# EAGLE design DragonHeadv2 (EAGLE 9.6.2)
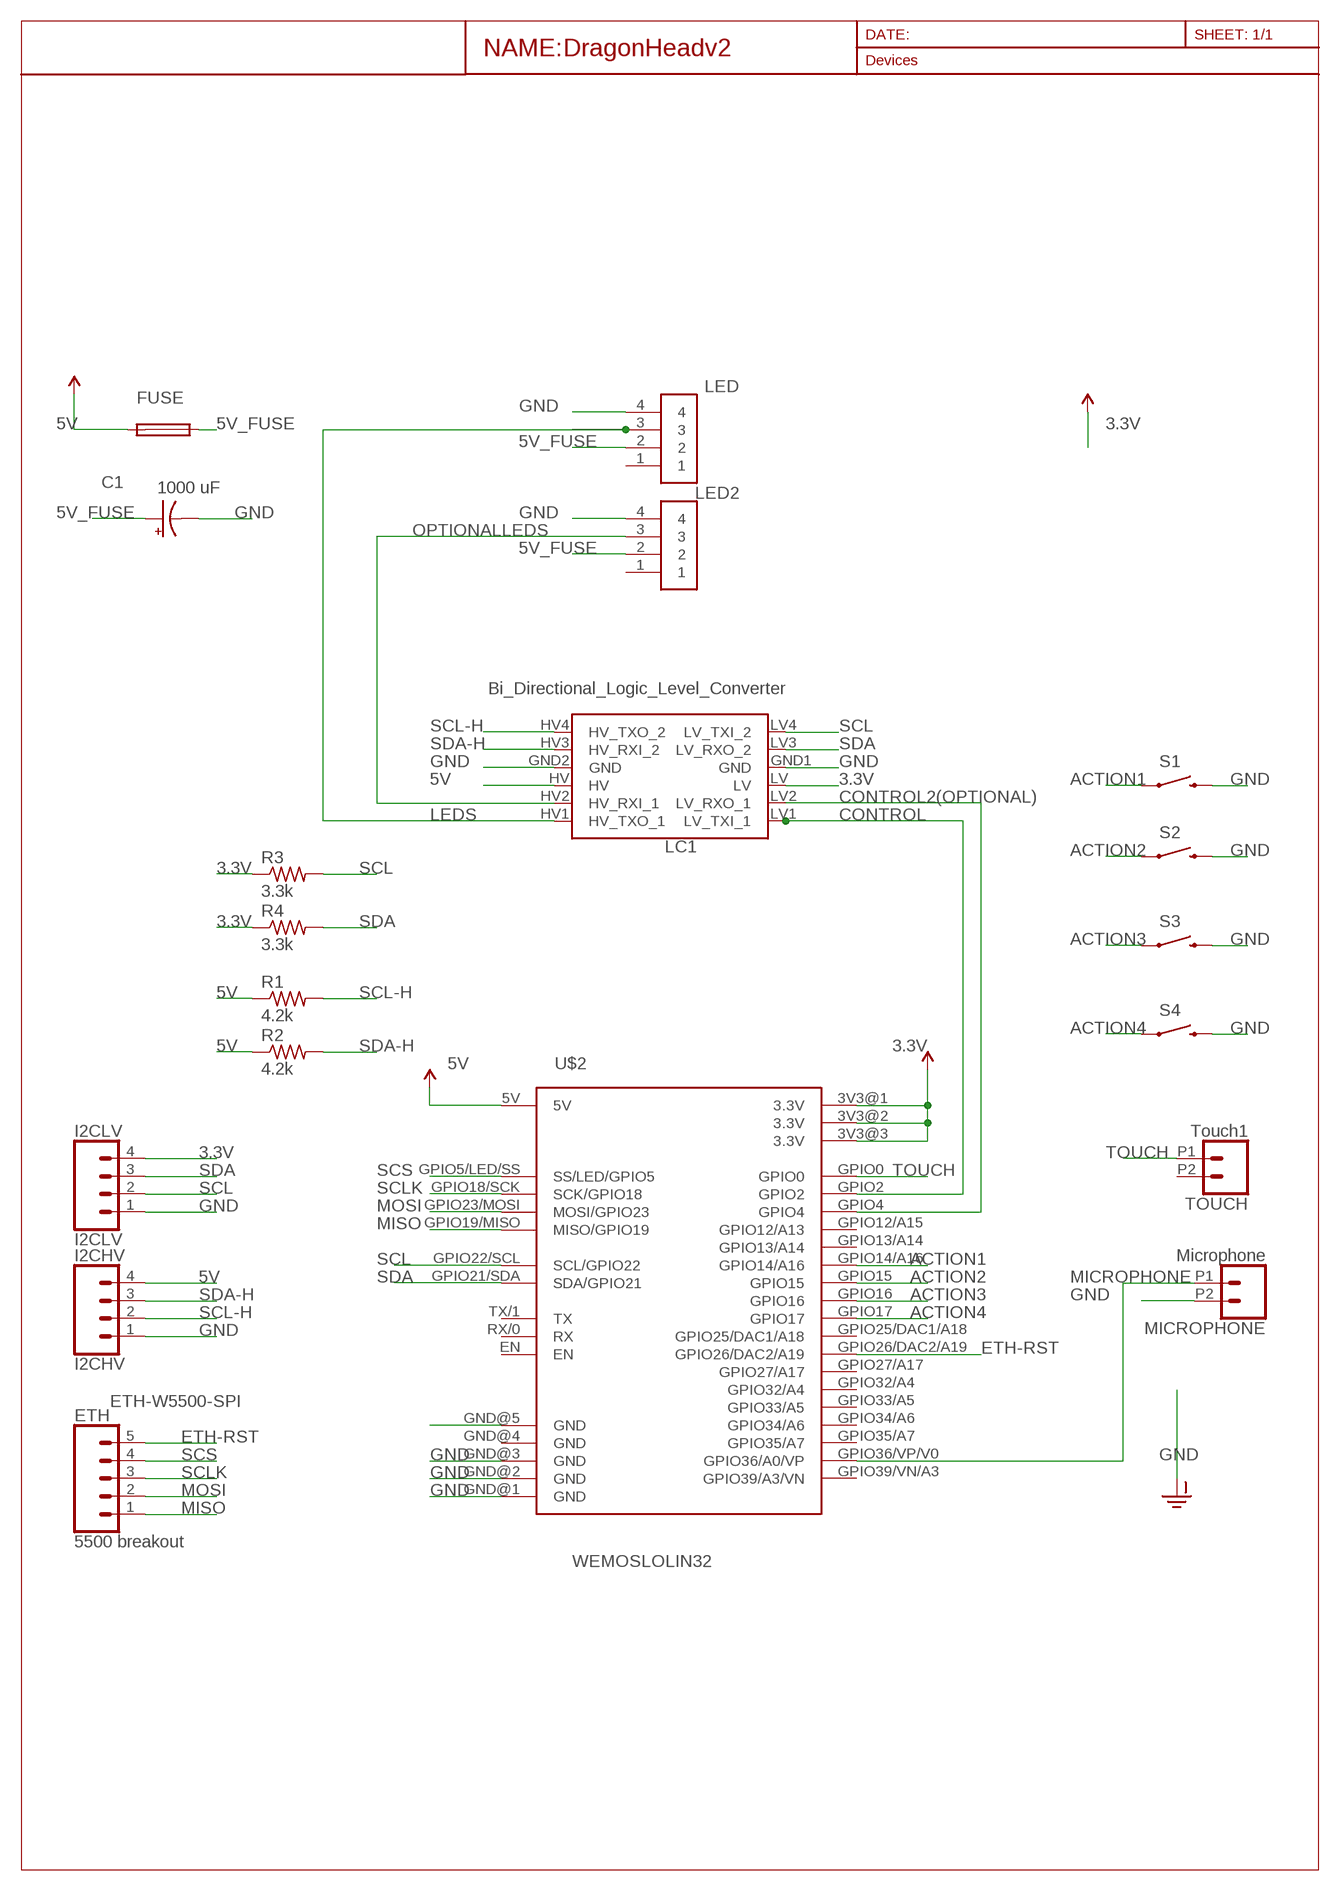
[diagram p0: schematic, sheet 1]

## Parts
C1  1000 uF  1000UF-RADIAL-5MM-25V-20%  [CPOL-RADIAL-5MM-10MM]
ETH  5500 breakout  CONN_05  [1X05]
FUSE  FUSEBLANK_5X20MM  [FUSE_HOLDER_5X20MM]
I2CHV  I2CHV  CONN_04PTH  [1X04]
I2CLV  I2CLV  CONN_04PTH  [1X04]
LC1  Bi_Directional_Logic_Level_Converter  SPARKFUN_LOGIC_LEVEL_CONVERTER  [SPARKFUN_LOGIC_LEVEL_CONVERTER]
LED  231-334/001-000  [WAGO_231-334/001-000]
LED2  231-334/001-000  [WAGO_231-334/001-000]
MICROPHONE  Microphone  CONN_022.54MM_SCREWTERM  [1X02_2.54_SCREWTERM]
R1  4.2k  R-US_0204/7  [0204/7]
R2  4.2k  R-US_0204/7  [0204/7]
R3  3.3k  R-US_0204/7  [0204/7]
R4  3.3k  R-US_0204/7  [0204/7]
S1  SWITCH-MOMENTARY-2SIDE_EZ  [TACTILE-PTH-SIDEEZ]
S2  SWITCH-MOMENTARY-2SIDE_EZ  [TACTILE-PTH-SIDEEZ]
S3  SWITCH-MOMENTARY-2SIDE_EZ  [TACTILE-PTH-SIDEEZ]
S4  SWITCH-MOMENTARY-2SIDE_EZ  [TACTILE-PTH-SIDEEZ]
TOUCH  Touch1  CONN_022.54MM_SCREWTERM  [1X02_2.54_SCREWTERM]
U$2  WEMOSLOLIN32  [LOLIN32VAR1]

## Nets
3.3V: I2CLV.4 LC1.LV R3.1 R4.1 U$2.3V3@1(3.3V) U$2.3V3@2(3.3V) U$2.3V3@3(3.3V)
5V: FUSE.2 I2CHV.4 LC1.HV R1.1 R2.1 U$2.5V
5V_FUSE: C1.+ FUSE.1 LED2.2 LED.2
ACTION1: S1.1 U$2.GPIO14/A16
ACTION2: S2.1 U$2.GPIO15
ACTION3: S3.1 U$2.GPIO16
ACTION4: S4.1 U$2.GPIO17
CONTROL: LC1.LV1(LV_TXI_1) U$2.GPIO2
CONTROL2(OPTIONAL): LC1.LV2(LV_RXO_1) U$2.GPIO4
ETH-RST: ETH.5 U$2.GPIO26/DAC2/A19
GND: C1.- I2CHV.1 I2CLV.1 LC1.GND1(GND) LC1.GND2(GND) LED2.4 LED.4 MICROPHONE.P2 S1.2 S2.2 S3.2 S4.2 U$2.GND@1(GND) U$2.GND@2(GND) U$2.GND@3(GND) U$2.GND@5(GND) ; supply symbol labelled GND-ISO
LEDS: LC1.HV1(HV_TXO_1) LED.3
MICROPHONE: MICROPHONE.P1 U$2.GPIO36/VP/V0(GPIO36/A0/VP)
MISO: ETH.1 U$2.GPIO19/MISO(MISO/GPIO19)
MOSI: ETH.2 U$2.GPIO23/MOSI(MOSI/GPIO23)
OPTIONALLEDS: LC1.HV2(HV_RXI_1) LED2.3
SCL: I2CLV.2 LC1.LV4(LV_TXI_2) R3.2 U$2.GPIO22/SCL(SCL/GPIO22)
SCL-H: I2CHV.2 LC1.HV4(HV_TXO_2) R1.2
SCLK: ETH.3 U$2.GPIO18/SCK(SCK/GPIO18)
SCS: ETH.4 U$2.GPIO5/LED/SS(SS/LED/GPIO5)
SDA: I2CLV.3 LC1.LV3(LV_RXO_2) R4.2 U$2.GPIO21/SDA(SDA/GPIO21)
SDA-H: I2CHV.3 LC1.HV3(HV_RXI_2) R2.2
TOUCH: TOUCH.P1 U$2.GPIO0
Unconnected: LED2.1 LED.1 TOUCH.P2 U$2.EN U$2.GND@4(GND) U$2.GPIO12/A15(GPIO12/A13) U$2.GPIO13/A14 U$2.GPIO25/DAC1/A18 U$2.GPIO27/A17 U$2.GPIO32/A4 U$2.GPIO33/A5 U$2.GPIO34/A6 U$2.GPIO35/A7 U$2.GPIO39/VN/A3(GPIO39/A3/VN) U$2.RX/0(RX) U$2.TX/1(TX)

## Library data of the parts
C1 = SparkFun-Capacitors:1000UF: 1,000µF/1mF ceramic capacitors A capacitor is a passive two-terminal electrical component used to store electrical energy temporarily in an electric field. CAP-08070; PROD_ID: CAP-09538; VALUE: 1mF
ETH = SparkFun-Connectors:CONN_05: Multi connection point. Often used as Generic Header-pin footprint for 0.1 inch spaced/style header connections On any of the 0.1 inch spaced packages, you can populate with these: Break Away Headers - Straight <https://www.sparkfun.com/products/116> (PRT-00116) Break Away Male Headers - Right Angle <https://www.sparkfun.com/products/553> (PRT-00553) Female Headers <https://www.sparkfun.com/products/115> (PRT-00115) Break Away Headers - Machine Pin <https://www.sparkfun.com/products/117> (PRT-00117) Break Away Female Headers - Swiss Machine Pin <https://www.sparkfun.com/products/743> (PRT-00743) For SCREWTERMINALS and SPRING TERMINALS visit here: Screw Terimnals on SparkFun.com <https://www.sparkfun.com/search/results?term=Screw+Terminals> (5mm/3.5mm/2.54mm spacing) This device is also useful as a general connection point to wire up your design to another part of your project. Our various solder wires solder well into these plated through hole pads. Hook-Up Wire - Assortment (Stranded, 22 AWG) <https://www.sparkfun.com/products/11375> (PRT-11375) Hook-Up Wire - Assortment (Solid Core, 22 AWG) <https://www.sparkfun.com/products/11367> (PRT-11367) View the entire wire category on our website here <https://www.sparkfun.com/categories/141> Special notes: Molex polarized connector foot print use with SKU : PRT-08231 with associated crimp pins and housings. 1MM SMD Version SKU: PRT-10208
FUSE = fuse:FUSE: Fuse; OC_FARNELL: unknown; OC_NEWARK: unknown
I2CHV I2CLV = SparkFun-Connectors:CONN_04: Multi connection point. Often used as Generic Header-pin footprint for 0.1 inch spaced/style header connections On any of the 0.1 inch spaced packages, you can populate with these: Break Away Headers - Straight <https://www.sparkfun.com/products/116> (PRT-00116) Break Away Male Headers - Right Angle <https://www.sparkfun.com/products/553> (PRT-00553) Female Headers <https://www.sparkfun.com/products/115> (PRT-00115) Break Away Headers - Machine Pin <https://www.sparkfun.com/products/117> (PRT-00117) Break Away Female Headers - Swiss Machine Pin <https://www.sparkfun.com/products/743> (PRT-00743) For SCREWTERMINALS and SPRING TERMINALS visit here: Screw Terimnals on SparkFun.com <https://www.sparkfun.com/search/results?term=Screw+Terminals> (5mm/3.5mm/2.54mm spacing) This device is also useful as a general connection point to wire up your design to another part of your project. Our various solder wires solder well into these plated through hole pads. Hook-Up Wire - Assortment (Stranded, 22 AWG) <https://www.sparkfun.com/products/11375> (PRT-11375) Hook-Up Wire - Assortment (Solid Core, 22 AWG) <https://www.sparkfun.com/products/11367> (PRT-11367) View the entire wire category on our website here <https://www.sparkfun.com/categories/141> Special notes: Molex polarized connector foot print use with SKU : PRT-08231 with associated crimp pins and housings. 1MM SMD Version SKU: PRT-10208; PROD_ID: CONN-09696
LC1 = SparkFun-Boards:SPARKFUN_LOGIC_LEVEL_CONVERTER: SparkFun Logic Level Converter -Bi-Directional This is the mechnical outline for the 3.3V - 5V bi directional logic level converter. *Note, the "LOCK" Package has the header pins staggered by an offset of 5 mils (off center line), so that when you slide a row of standard 0.1" headers into the PTH pads, it will hold position vertically. See the follwing turorial for more information on this type of special footprints: Sneaky Footprints <https://www.sparkfun.com/tutorials/114> SparkFun Products: SparkFun Logic Level Converter - Bi-Directional <https://www.sparkfun.com/products/12009>
LED LED2 = 231-334_001-000:231-334/001-000: 4 Position 5.08 mm Through Hole Header Straight Solder Pin with Closed End Check availability <https://pricing.snapeda.com/parts/231-334/001-000/WAGO/view-part?ref=eda>; AVAILABILITY: In Stock; DESCRIPTION: 4 Position 5.08 mm Through Hole Header Straight Solder Pin with Closed End; MF: WAGO; MP: 231-334/001-000; PACKAGE: None; PRICE: None; PURCHASE-URL: https://pricing.snapeda.com/search/part/231-334/001-000/?ref=eda
MICROPHONE TOUCH = SparkFun-Retired:CONN_02: Multi connection point. Often used as Generic Header-pin footprint for 0.1 inch spaced/style header connections On any of the 0.1 inch spaced packages, you can populate with these: Break Away Headers - Straight <https://www.sparkfun.com/products/116> (PRT-00116) Break Away Male Headers - Right Angle <https://www.sparkfun.com/products/553> (PRT-00553) Female Headers <https://www.sparkfun.com/products/115> (PRT-00115) Break Away Headers - Machine Pin <https://www.sparkfun.com/products/117> (PRT-00117) Break Away Female Headers - Swiss Machine Pin <https://www.sparkfun.com/products/743> (PRT-00743) For SCREWTERMINALS and SPRING TERMINALS visit here: Screw Terimnals on SparkFun.com <https://www.sparkfun.com/search/results?term=Screw+Terminals> (5mm/3.5mm/2.54mm spacing) This device is also useful as a general connection point to wire up your design to another part of your project. Our various solder wires solder well into these plated through hole pads. Hook-Up Wire - Assortment (Stranded, 22 AWG) <https://www.sparkfun.com/products/11375> (PRT-11375) Hook-Up Wire - Assortment (Solid Core, 22 AWG) <https://www.sparkfun.com/products/11367> (PRT-11367) View the entire wire category on our website here <https://www.sparkfun.com/categories/141> Special notes: Molex polarized connector foot print use with: PRT-08233 with associated crimp pins and housings. 2.54_SCREWTERM for use with PRT-10571. 3.5mm Screw Terminal footprints for PRT-08084 5mm Screw Terminal footprints for use with PRT-08432
R1-R4 = adafruit:R-US_: RESISTOR, American symbol
S1-S4 = SparkFun-Electromechanical:SWITCH-MOMENTARY-2: Various NO switches- pushbuttons, reed, etc
U$2 = LOLIN32:WEMOSLOLIN32: WEMOS LOLIN32 CPU with Wifi and 4Gb flash storage

## Board
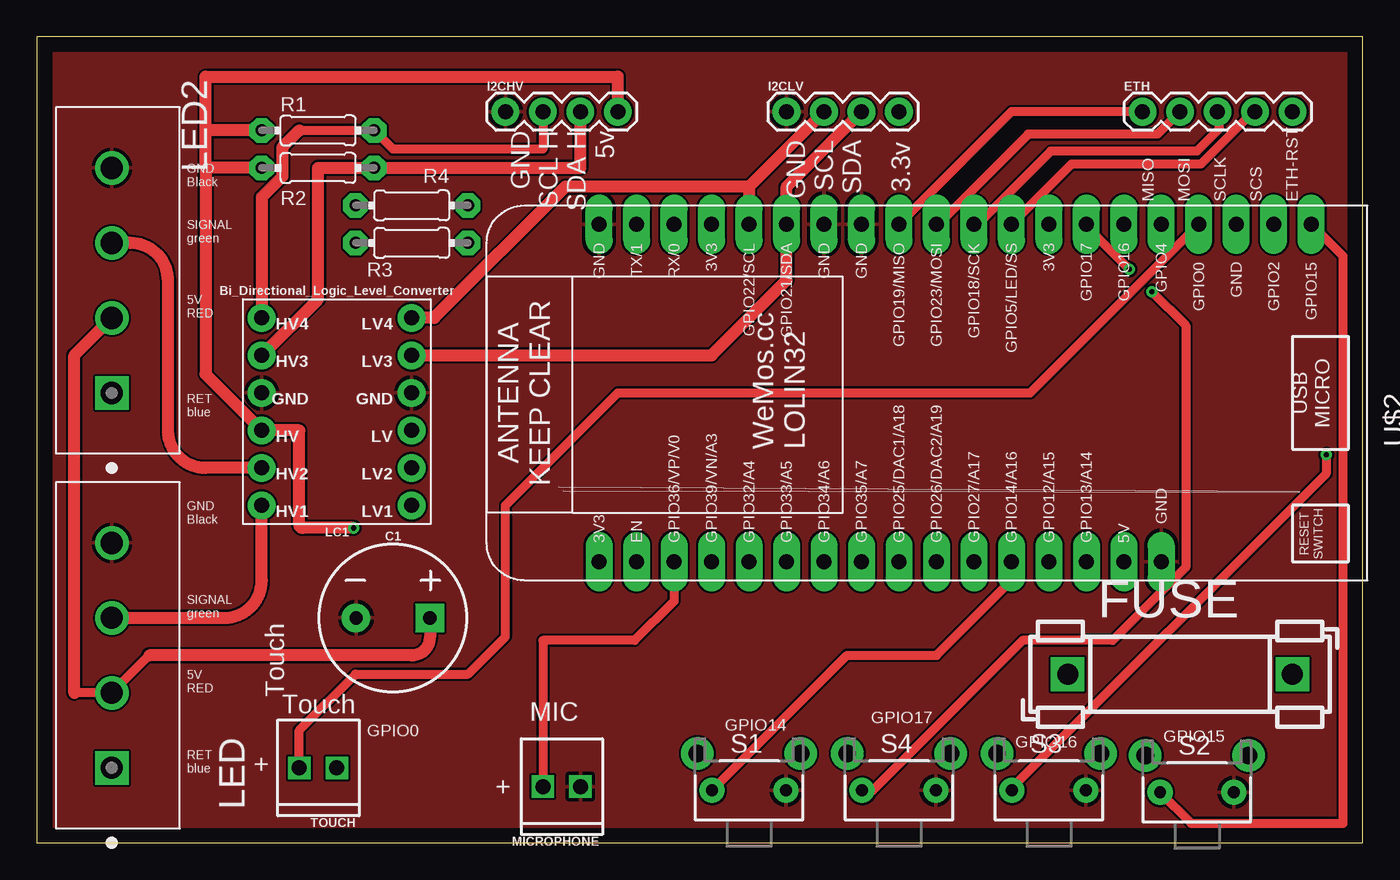
[diagram p1: board, top side]
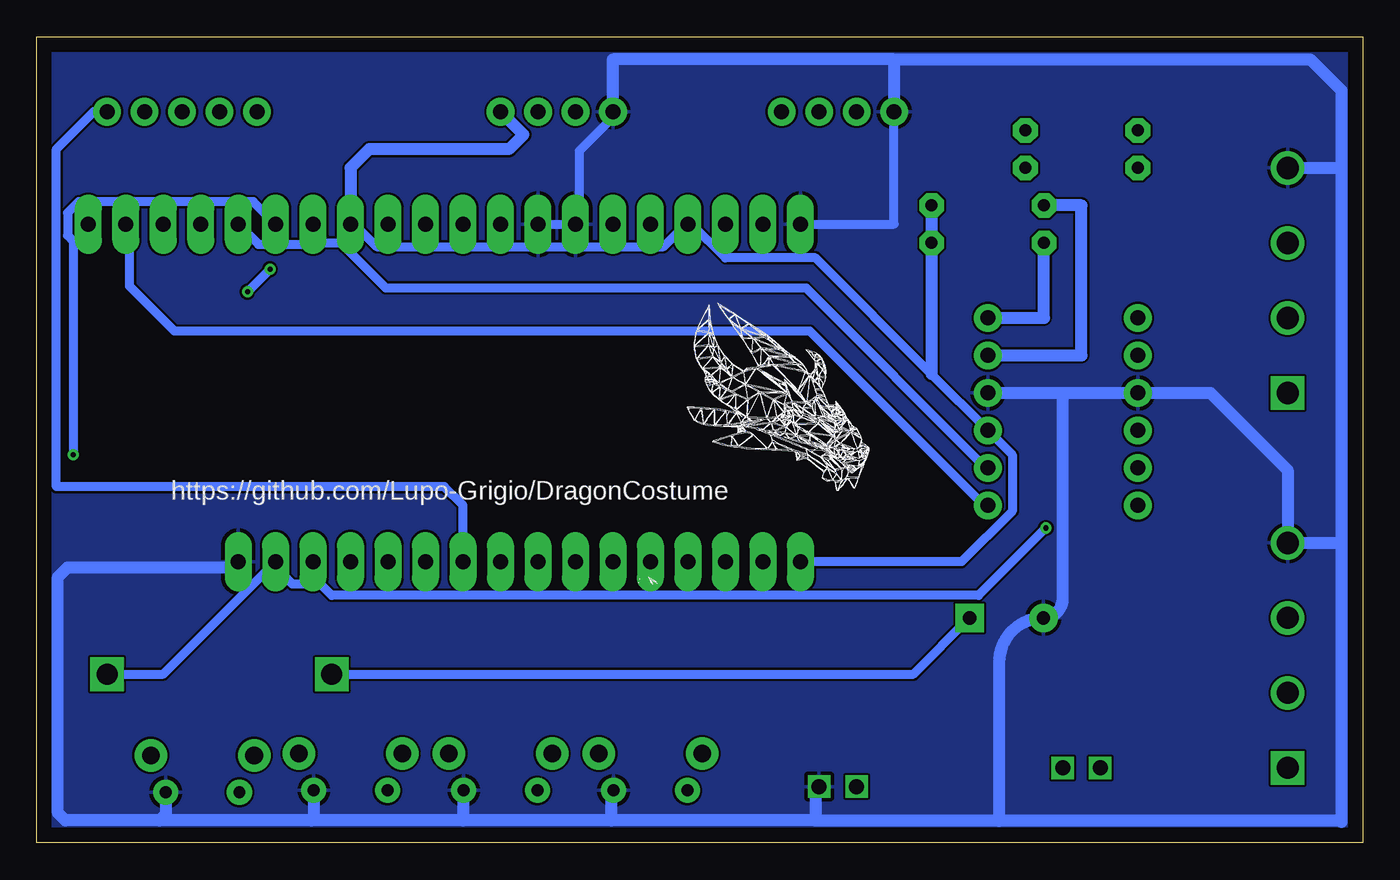
[diagram p2: board, bottom side, seen from below]

Size 89.84 x 54.6 mm. Coordinates in mm from the lower left corner, seen from the top.
Outline: 0,0 89.84,0 89.84,54.6 0,54.6 0,0
Copper layers (1*16): Top 0.035mm / dielectric 1.5mm / Bottom 0.035mm
Design rules "default *": minimum track width 24mil, minimum drill 0.35mm, track to track 6mil, track to pad 6mil, pad to pad 6mil, via to via 6mil, smd to smd 6mil, copper to edge 40mil, drill to drill 6mil, minimum pad ring 10mil, minimum via ring 8mil, stop-mask expansion 4mil, vias tented up to drill 0mil, thermal gap 10mil

### Footprints (pad centres in the part's own frame; a part is rotated, then mirrored left to right if it is on the bottom)
CPOL-RADIAL-5MM-10MM = drill 0.9 pad 1.93 square: + 2.5,0 | drill 0.9 pad 1.93: - -2.5,0
1X05 = drill 1.016 pad 1.88: 1 0,0; 2 2.54,0; 3 5.08,0; 4 7.62,0; 5 10.16,0
FUSE_HOLDER_5X20MM = drill 1.422 pad 2.286 square: 1 0,0; 2 15.24,0
1X04 = drill 1.016 pad 1.88: 1 0,0; 2 2.54,0; 3 5.08,0; 4 7.62,0
SPARKFUN_LOGIC_LEVEL_CONVERTER = drill 1.016 pad 1.88: GND1 -5.08,-1.27; GND2 5.08,-1.27; HV 5.08,1.27; HV1 5.08,6.35; HV2 5.08,3.81; HV3 5.08,-3.81; HV4 5.08,-6.35; LV -5.08,1.27; LV1 -5.08,6.35; LV2 -5.08,3.81; LV3 -5.08,-3.81; LV4 -5.08,-6.35
WAGO_231-334/001-000 = drill 1.5 square: 1 -7.62,0 | drill 1.5: 2 -2.54,0; 3 2.54,0; 4 7.62,0
1X02_2.54_SCREWTERM = drill 1.016 square: P1 2.54,0; P2 0,0
0204/7 = drill 0.813 pad 1.676 octagon: 1 -3.81,0; 2 3.81,0
TACTILE-PTH-SIDEEZ = drill 0.8 pad 1.7: 1 -2.5,0; 2 2.5,0 | drill 1.2 pad 2.2: ANCHOR1 -3.5,2.5; ANCHOR2 3.5,2.5
LOLIN32VAR1 = drill 1.016 pad 1.829 long: 3V3@1 -11.43,24.13; 3V3@2 11.43,16.51; 3V3@3 11.43,-6.35; 5V -11.43,-11.43; EN -11.43,21.59; GND@1 11.43,24.13; GND@2 11.43,8.89; GND@3 11.43,6.35; GND@4 11.43,-19.05; GND@5 -11.43,-13.97; GPIO0 11.43,-16.51; GPIO2 11.43,-21.59; GPIO4 11.43,-13.97; GPIO5/LED/SS 11.43,-3.81; GPIO12/A15 -11.43,-6.35; GPIO13/A14 -11.43,-8.89; GPIO14/A16 -11.43,-3.81; GPIO15 11.43,-24.13; GPIO16 11.43,-11.43; GPIO17 11.43,-8.89; GPIO18/SCK 11.43,-1.27; GPIO19/MISO 11.43,3.81; GPIO21/SDA 11.43,11.43; GPIO22/SCL 11.43,13.97; GPIO23/MOSI 11.43,1.27; GPIO25/DAC1/A18 -11.43,3.81; GPIO26/DAC2/A19 -11.43,1.27; GPIO27/A17 -11.43,-1.27; GPIO32/A4 -11.43,13.97; GPIO33/A5 -11.43,11.43; GPIO34/A6 -11.43,8.89; GPIO35/A7 -11.43,6.35; GPIO36/VP/V0 -11.43,19.05; GPIO39/VN/A3 -11.43,16.51; RX/0 11.43,19.05; TX/1 11.43,21.59

### Placement (x,y rotation side)
C1  24.13,15.24 0 top
ETH  74.93,49.53 0 top
FUSE  69.85,11.43 0 top
I2CHV  31.75,49.53 0 top
I2CLV  50.8,49.53 0 top
LC1  20.32,29.21 180 top
LED  5.08,12.7 90 top
LED2  5.08,38.1 90 top
MICROPHONE  36.83,3.81 180 top
R1  19.05,48.26 0 top
R2  19.05,45.72 0 top
R3  25.4,40.64 180 top
R4  25.4,43.18 180 top
S1  48.26,3.56 0 top
S2  78.61,3.43 0 top
S3  68.58,3.56 0 top
S4  58.42,3.56 0 top
TOUCH  20.32,5.08 180 top
U$2  62.23,30.48 90 top

### Tracks (layer width: path | path; a pad name or v marks a point on that pad's centre or on a via)
3.3V
  Bottom 0.61: U$2.3V3@3 68.33,41.91 66.8,40.39 47.37,40.39 45.85,41.91 U$2.3V3@2 45.47,41.91 43.18,39.62 37.08,39.62 29.21,31.75 LC1.LV 23.75,26.29 23.75,22.48 27.18,19.05 U$2.3V3@1
  Bottom 0.813: R4.1 R3.1 29.21,31.75 | I2CLV.4 56.87,47.98 57.86,46.99 67.31,46.99 68.58,45.72 U$2.3V3@3
5V  (via drill 0.35)
  Top 0.813: R2.1 11.43,45.72 | 11.43,45.72 11.43,31.75 LC1.HV 17.78,27.94 17.78,21.59 arc90 18.03,21.34 v21.46,21.34 | R1.1 11.43,48.26 | 11.43,45.72 11.43,48.26 | 11.43,48.26 11.43,51.91 39.37,51.91 I2CHV.4
  Bottom 0.61: FUSE.2 81.28,11.43 U$2.5V 73.66,18.67 72.52,17.53 70.61,17.53 69.85,16.76 26.04,16.76 v21.46,21.34
5V_FUSE
  Top 0.61: 7.62,12.7 LED.2 2.54,10.16
  Top 0.813: 7.62,12.7 25.4,12.7 arc90 26.63,13.93 C1.+ | 2.54,10.16 2.54,33.02 LED2.2
  Bottom 0.61: C1.+ 30.44,11.43 FUSE.1
ACTION1
  Top 0.61: U$2.GPIO14/A16 66.04,17.78 60.96,12.7 54.9,12.7 S1.1
ACTION2
  Top 0.61: U$2.GPIO15 88.52,39.75 88.52,1.32 78.22,1.32 S2.1
ACTION3  (via drill 0.35)
  Top 0.61: v87.38,26.29 87.38,25.02 66.08,3.72 S3.1
  Bottom 0.61: v87.38,26.29 87.38,40.77 87.76,41.15 87.76,42.67 87,43.43 75.18,43.43 U$2.GPIO16
ACTION4  (via drill 0.35)
  Top 0.61: S4.1 56.64,3.56 66.8,13.72 72.9,13.72 77.85,18.67 77.85,35.05 v75.56,37.34 | v74.04,38.86 70.99,41.91 U$2.GPIO17
  Bottom 0.61: v74.04,38.86 v75.56,37.34
CONTROL
  Bottom 0.61: U$2.GPIO2 83.57,41.91 83.57,37.72 80.52,34.67 37.47,34.67 25.65,22.86 LC1.LV1
CONTROL2(OPTIONAL)
  Bottom 0.61: U$2.GPIO4 74.83,40.54 70.55,40.54 70.45,40.64 69.25,40.64 66.2,37.59 37.72,37.59 25.65,25.53 LC1.LV2
ETH-RST
  Bottom 0.61: U$2.GPIO26/DAC2/A19 60.96,22.86 62.23,24.13 88.52,24.13 88.52,46.99 85.98,49.53 ETH.5
GND
  Bottom 0.61: I2CHV.1 31.75,41.91 U$2.GND@1 | I2CLV.1 50.8,49.15 53.09,46.86 53.09,41.91 U$2.GND@2 U$2.GND@3
  Bottom 0.813: 31.75,53.09 50.8,53.09 I2CLV.1 | 31.75,53.09 3.56,53.09 1.42,50.95 1.42,45.72 | 20.32,30.48 20.32,16.55 arc90 C1.- arc-90 24.64,12.23 24.64,1.49 | 20.32,30.48 LC1.GND2 10.31,30.48 5.08,25.25 LED.4 1.55,20.32 1.42,20.45 | LC1.GND1 20.32,30.48 | 31.75,53.09 I2CHV.1 | 37.08,1.52 50.93,1.52 | 50.93,1.52 60.96,1.52 | 60.96,1.52 71.25,1.52 | 71.25,1.52 81.53,1.52 | 81.53,1.52 87.91,1.52 88.42,2.03 88.42,18.01 87.76,18.67 76.58,18.67 U$2.GND@5 | MICROPHONE.P2 37.08,3.56 37.08,1.52 | S1.2 50.93,3.39 50.93,1.52 | S4.2 60.96,3.52 60.96,1.52 | S3.2 71.08,1.69 71.25,1.52 | S2.2 81.11,1.95 81.53,1.52 | 1.42,20.45 1.42,1.42 1.52,1.52 37.08,1.52 | 1.42,20.45 1.42,45.72 | LED2.4 1.42,45.72
  pour Bottom: 89.53,54.23 89.41,0.38 0.38,0.63 0.51,54.36
  pour Top: 89.66,53.72 89.53,53.59 89.41,0.76 0.63,0.89 0.51,53.98 89.66,53.98
LEDS
  Top 0.813: LC1.HV1 15.24,17.78 arc-90 12.7,15.24 LED.3
MICROPHONE
  Top 0.61: U$2.GPIO36/VP/V0 43.18,16.38 40.51,13.72 34.29,13.72 MICROPHONE.P1
MISO
  Top 0.61: U$2.GPIO19/MISO 66.04,49.53 ETH.1
MOSI
  Top 0.61: ETH.2 75.95,48.01 67.18,48.01 61.09,41.91 U$2.GPIO23/MOSI
OPTIONALLEDS
  Top 0.813: LC1.HV2 11.43,25.4 arc-90 8.89,27.94 8.89,38.1 arc90 6.35,40.64 LED2.3
SCL
  Top 0.61: LC1.LV4 25.65,35.81 25.65,35.56
  Top 0.813: 25.65,35.56 26.92,35.56 35.81,44.45 48.26,44.45 | I2CLV.2 48.26,44.45 | 48.26,44.45 U$2.GPIO22/SCL
  Bottom 0.813: LC1.LV4 21.59,35.56 R3.2
SCL-H
  Top 0.61: 17.78,48.26 R1.2 24.13,46.99 34.29,46.99 I2CHV.2
  Top 0.813: 17.78,48.26 16.64,47.12 16.64,45.14 15.24,43.74 LC1.HV4
SCLK
  Top 0.61: U$2.GPIO18/SCK 63.75,41.91 68.71,46.86 78.61,46.86 80.14,48.39 80.14,49.53 ETH.3
SCS
  Top 0.61: U$2.GPIO5/LED/SS 70.1,45.97 78.87,45.97 82.42,49.53 ETH.4
SDA
  Top 0.813: LC1.LV3 45.72,33.02 50.8,38.1 U$2.GPIO21/SDA 50.8,44.45 I2CLV.3
  Bottom 0.813: R4.2 19.05,43.18 19.05,33.02 LC1.LV3
SDA-H
  Top 0.813: I2CHV.3 36.83,45.72 R2.2 19.05,45.72 19.05,36.83 LC1.HV3
TOUCH
  Top 0.61: TOUCH.P1 17.78,7.62 21.59,11.43 29.21,11.43 31.75,13.97 31.75,22.86 39.37,30.48 67.31,30.48 U$2.GPIO0

### Text on the board
tPlace: GND / SCL H / SDA H / 5v | GND / SCL / SDA | 3.3v | GND / Black | MISO / / MOSI / / SCLK / / SCS / / ETH-RST | SIGNAL / green | 5V / RED | RET / blue | GND / Black | SIGNAL / green | 5V / RED | Touch | Touch | MIC | GPIO14 | GPIO17 | GPIO0 | GPIO16 | GPIO15 | + | + | RET / blue
bPlace: https://github.com/Lupo-Grigio/DragonCostume